# Altium schematic sheet MAX3232.SchDoc
size A4; SheetNumber: 1; SheetTotal: 1
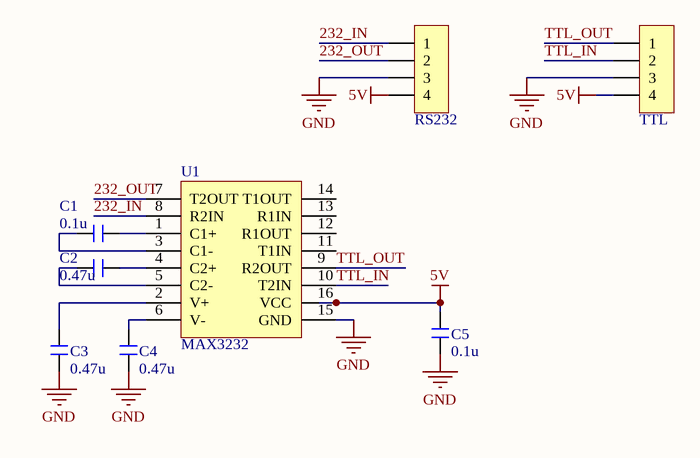
[diagram p0: MAX3232.SchDoc]

## Parts
C1  0.1u  [C 0603_L]
C2  0.47u  [C 0603_L]
C3  0.47u  [C 0603_L]
C4  0.47u  [C 0603_L]
C5  0.1u  [C 0603_L]
RS232  HDR-1X4  [XH2.54-WI-4P]  (value not drawn)
TTL  HDR-1X4  [GH1.25-WS-4P]  (value not drawn)
U1  MAX3232  [SOIC-16]

## Nets
5V: C5.2 RS232.4 TTL.4 U1.16(VCC)
GND: C3.1 C4.1 C5.1 RS232.3 TTL.3 U1.15(GND)
232_IN: RS232.1 U1.8(R2IN)
232_OUT: RS232.2 U1.7(T2OUT)
TTL_IN: TTL.2 U1.10(T2IN)
TTL_OUT: TTL.1 U1.9(R2OUT)
NetC1_1: C1.1 U1.3(C1-)
NetC1_2: C1.2 U1.1(C1+)
NetC2_1: C2.1 U1.5(C2-)
NetC2_2: C2.2 U1.4(C2+)
NetC3_2: C3.2 U1.2(V+)
NetC4_2: C4.2 U1.6(V-)

Not connected (* = marked no-connect by the designer): U1 11(T1IN) 12(R1OUT) 13(R1IN) 14(T1OUT)

## Library data of the parts
C1-C5 = C: 贴片电容; 淘宝ID: 小糖豆的小窝窝; BOM名称: 贴片电容; 下单链接: https://item.taobao.com/item.htm?ft=t&id=613637044352
RS232 TTL = Header 4: 4P接插件; 淘宝ID: 小糖豆的小窝窝; BOM名称: 4P接插件; 下单链接: https://item.taobao.com/item.htm?ft=t&id=613637044352
U1 = MAX3232: 通讯IC; 淘宝ID: 小糖豆的小窝窝; Alias1: https://item.taobao.com/item.htm?ft=t&id=613637044352; BOM名称: 通讯IC